# Altium schematic sheet SdpSchemRev1.SchDoc
size A
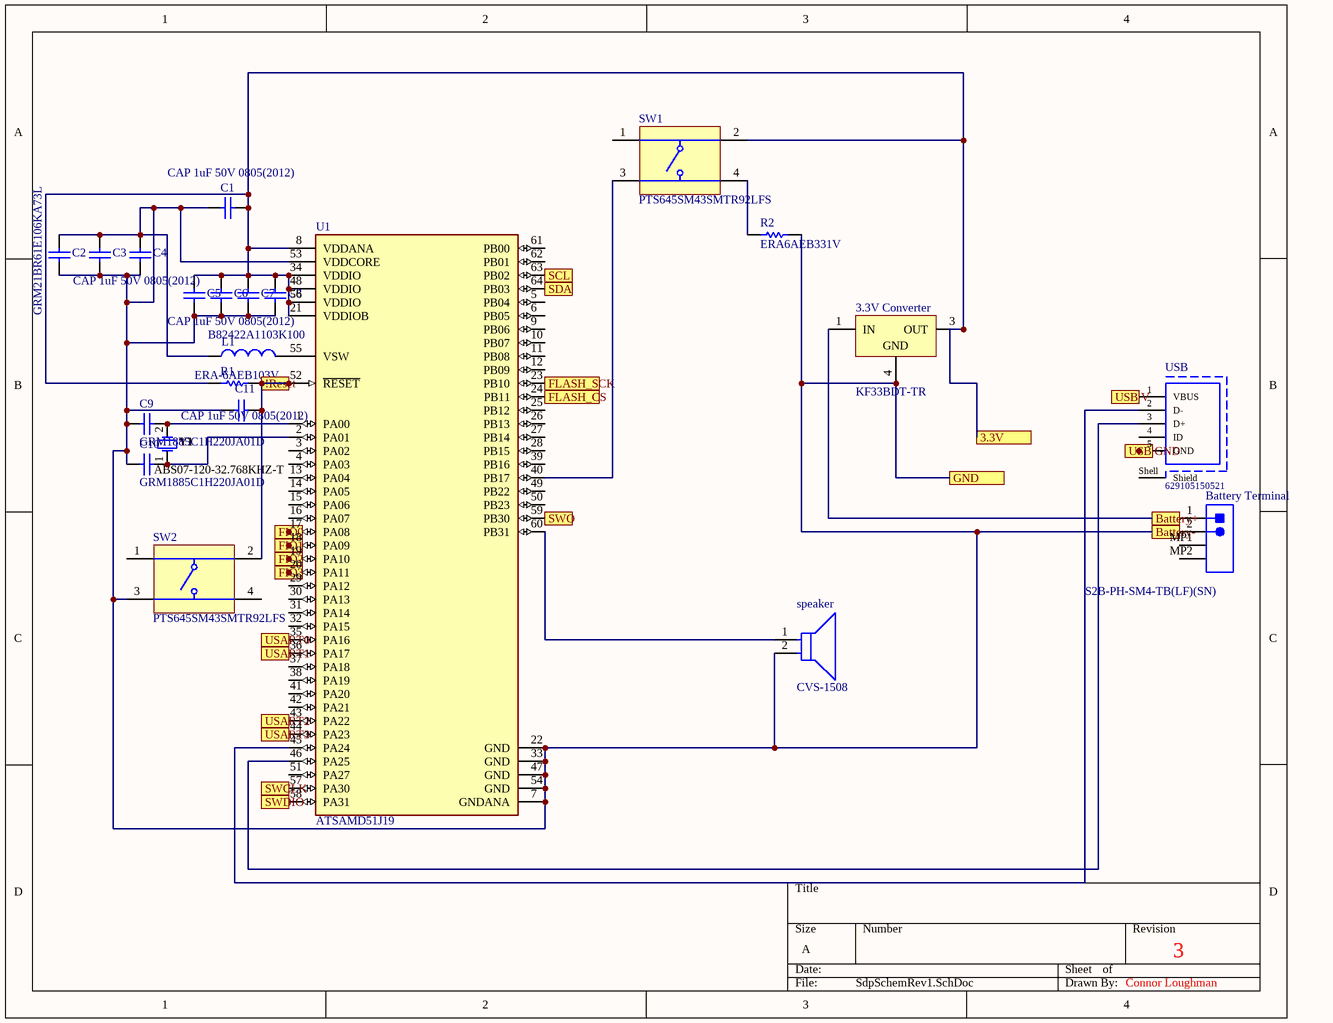
[diagram p0: SdpSchemRev1.SchDoc]

## Parts
3.3V_Converter  KF33BDT-TR  [TO-252_L]
Battery_Terminal  S2B-PH-SM4-TB(LF)(SN)  [JST- S2B-PH-SM4-TB(LF)(SN)-2_V]
C1  CAP 1uF 50V 0805(2012)  [CAPC0805(2012)145_L]
C2  GRM21BR61E106KA73L  [CAPC2013X135X45ML10T25]
C3  (no value)  [CAPC0805(2012)145_L]
C4  CAP 1uF 50V 0805(2012)  [CAPC0805(2012)145_L]
C5  (no value)  [CAPC0805(2012)145_L]
C6  (no value)  [CAPC0805(2012)145_L]
C7  (no value)  [CAPC0805(2012)145_L]
C8  CAP 1uF 50V 0805(2012)  [CAPC0805(2012)145_L]
C9  GRM1885C1H220JA01D  [CAPC1608X90X35ML10T15]
C10  GRM1885C1H220JA01D  [CAPC1608X90X35ML10T15]
C11  CAP 1uF 50V 0805(2012)  [CAPC0805(2012)145_L]
L1  B82422A1103K100  [TDK-B82422A1103K100_V]
R1  ERA-6AEB103V  [RESC2013X60X40LL20T25_A]
R2  ERA6AEB331V  [RESC2013X60X40LL20T25]
speaker  CVS-1508  [FP-CVS-1508-MFG]
SW1  PTS645SM43SMTR92LFS  [ITT-PTS645S-4_V]
SW2  PTS645SM43SMTR92LFS  [ITT-PTS645S-4_V]
U1  ATSAMD51J19  [FP-C04-085-MFG]
USB  629105150521  [629105150521]
Y1  ABS07-120-32.768KHZ-T  [ABRA-ABS07_A_V]

## Ports
3.3V, !Reset, Battery+, Battery-, FIO0, FIO1, FIO2, FIO3, FLASH_CS, FLASH_SCK, GND, SCL, SDA, SWCLK, SWDIO, SWO, USART0, USART1, USART2, USART3, USB GND, USB V

## Nets
3.3V: 3.3V_Converter.3(OUT) C1.2 C5.2 C6.2 C7.2 C8.2 R1.1 SW1.2 U1.8(VDDANA) U1.21(VDDIOB) U1.34(VDDIO) U1.48(VDDIO) U1.56(VDDIO) ; port 3.3V
!Reset: C11.2 R1.2 SW2.2 U1.52(~{RESET}) ; port !Reset
Battery+: 3.3V_Converter.1(IN) Battery_Terminal.1 ; port Battery+
Battery-: 3.3V_Converter.4(GND) Battery_Terminal.2 C1.1 C2.1 C2.2 C3.1 C3.2 C4.1 C4.2 C5.1 C6.1 C7.1 C8.1 C9.1 C10.1 C11.1 L1.1 R2.2 speaker.2(A) SW2.3 U1.7(GNDANA) U1.22(GND) U1.33(GND) U1.47(GND) U1.53(VDDCORE) U1.54(GND) ; port GND, port Battery-
FLASH_CS: U1.24(PB11) ; port FLASH_CS
FLASH_SCK: U1.23(PB10) ; port FLASH_SCK
SCL: U1.63(PB02) ; port SCL
SDA: U1.64(PB03) ; port SDA
SWCLK: U1.57(PA30) ; port SWCLK
SWDIO: U1.58(PA31) ; port SWDIO
SWO: U1.59(PB30) ; port SWO
USART0: U1.35(PA16) ; port USART0
USART1: U1.36(PA17) ; port USART1
USART2: U1.43(PA22) ; port USART2
USART3: U1.44(PA23) ; port USART3
USB V: USB.1(VBUS) ; port USB V
NetC9_2: C9.2 U1.1(PA00) Y1.2
NetC10_2: C10.2 U1.2(PA01) Y1.1
NetL1_2: L1.2 U1.55(VSW)
NetR2_1: R2.1 SW1.4
Netspeaker_1: speaker.1(C) U1.60(PB31)
NetSW1_3: SW1.3 U1.40(PB17)
NetU1_45: U1.45(PA24) USB.2(D-)
NetU1_46: U1.46(PA25) USB.3(D+)

Not connected (* = marked no-connect by the designer): Battery_Terminal MP1 MP2; SW1 1; SW2 1 4; U1 3(PA02) 4(PA03) 5(PB04) 6(PB05) 9(PB06) 10(PB07) 11(PB08) 12(PB09) 13(PA04) 14(PA05) 15(PA06) 16(PA07) 17(PA08) 18(PA09) 19(PA10) 20(PA11) 25(PB12) 26(PB13) 27(PB14) 28(PB15) 29(PA12) 30(PA13) 31(PA14) 32(PA15) 37(PA18) 38(PA19) 39(PB16) 41(PA20) 42(PA21) 49(PB22) 50(PB23) 51(PA27) 61(PB00) 62(PB01); USB 4(ID) 5(GND) Shell(Shield)

## Notes on the sheet
- 3
- Connor Loughman

## Library data of the parts
3.3V_Converter = CMP-0244-00072-1: Very Low Drop Voltage Regulators with Inhibit, 3.3V, 3-Pin DPAK, Tape and Reel; DatasheetVersion: 21/02/2008; ComponentLink2Description: Datasheet; ComponentLink1URL: http://www.st.com; PackageVersion: 2011; ComponentLink1Description: Manufacturer URL; PackageDescription: 3-Pin Transistor Outline Package 2.28 mm Pitch, 9.7 mm Lead Span (DPAK); ComponentLink2URL: http://www.st.com/internet/com/TECHNICAL_RESOURCES/TECHNICAL_LITERATURE/DATASHEET/CD00000970.pdf; PackageReference: TO-252
Battery_Terminal = CMP-1755-00001-1: Male Header, Pitch 2 mm, 1 x 2 Position, Height 5.5 mm, -25 to 85 degC, RoHS, Tape and Reel; Current Rating: 3 A; ComponentLink1URL: http://www.jst.com/home2.html; Radiation Hardening: No; RoHSCompliant: True; Mount: Through Hole; Contact Material: Bronze; Package Quantity: 100; Width: 2.34 mm; DatasheetVersion: Dec-12; Height: 8.13 mm; Max Operating Temperature: 105degC; ComponentLink2Description: Datasheet; Lead Pitch: 0.1 inch; Contact Finish: Lead; Packaging: Bulk; Colour: Black; Contact Plating: Tin; Min Operating Temperature: -65degC; ComponentLink1Description: Manufacturer URL; PackageReference: S2B-PH-SM4-TB(LF)(SN)-2; PackageDescription: Male Header, Pitch 2 mm, 1 x 2 Position, Height 5.5 mm; ComponentLink2URL: http://www.jst-mfg.com/product/pdf/eng/ePH.pdf; Pins: 40; Length: 101.19 mm
C1 C3-C8 C11 = CMP-1036-04761-1: CAP 1uF 50V ±10% 0805 (2012 Metric) Thickness 1.45mm SMD; Tolerance: Â±10%; Case-EIA: 0805; Case-Metric: 2012; Technology: SMT; Value: 1uF; Max Thickness: 1.45 mm; Rated Voltage: 50 V
C2 = CMP-2007-03541-1: Manufacturer: Murata; Part Number: GRM21BR61E106KA73L
C9 C10 = CMP-2000-04945-1: Chip Capacitor, 22 pF, +/- 5%, 50 V, -55 to 125 degC, 0603 (1608 Metric), RoHS, Tape and Reel; Manufacturer: Murata; Capacitance: 22pF; Rated Voltage: 50V; Dielectric: C0G; Manufacturer URL: http://www.murata.com/; Datasheet Version: Jul-06; Package Reference: 603; Tolerance (%): ±5%; Case Size/Dimension: 0603; Package Description: 2-Pin Surface Mount Device, Body 1.6 x 0.8 mm; Datasheet URL: https://datasheet.ciiva.com/11786/0900766b807a1cab-11786398.pdf
L1 = CMP-2000-05912-1: Wirewound Inductor, 10 uF, +/- 10%, 180 mA, -55 to 125 degC, 2-Pin SMD, RoHS, Tape and Reel; Manufacturer: EPCOS-(TDK); Frequency - Test: 1MHz; Current Rating: 180mA; Material - Core: Ferrite; Inductance: 10µH; DC Resistance (DCR): 1.6OhmMax; Q @ Freq: 27@2.52MHz; Frequency - Self Resonant: 25MHz; Shielding: Unshielded; Series: SIMID; Size / Dimension: 0.126"Lx0.098"W(3.20mmx2.50mm); Mounting Type: SurfaceMount; Current - Saturation: -; Operating Temperature: -; Datasheet URL: https://en.tdk.eu/inf/30/db/ind_2008/b82422a_100.pdf; Ratings: AEC-Q200; Category: Inductors,Coils,Chokes; Mounting Technology: SurfaceMount; Height - Seated (Max): 0.083"(2.10mm); Family: FixedInductors; Package / Case: 1210(3225Metric); Tolerance: ±10%; Manufacturer URL: http://www.tdk.com/; Datasheet Version: 10/2012; Type: Wirewound; Packaging: CutTape(CT); Package Description: 2-Pin Surface Mount Device, Body 3.2 x 2.5 mm; Package Reference: B82422A1103K100
R1 = CMP-2000-06228-1: Metal Film Chip Resistor, High Reliability Type, 0.125 W, +/- 0.1%, -55 to 155 degC, 0805 (2012 Metric), RoHS, Tape and Reel; Voltage Rating: 100V; Power Rating: 125mW(1/8W); Brand: Panasonic; Temperature Coefficient: 25PPM/C; Resistance: 10kOhms; Product Category: ThinFilmResistors-SMD; Datasheet Version: 02/2016; Operating Temperature Range: -55Cto+155C; Length: 2mm; Mounting Technology: SurfaceMount; Manufacturer URL: http://www.panasonic.com/; Width: 1.25mm; Packaging: Reel; Product: ThinFilmResistorsSMD; Package / Case: 0805(2012metric); Termination Style: SMD/SMT; Tolerance: 0.1%; Datasheet URL: https://industrial.panasonic.com/cdbs/www-data/pdf/RDM0000/AOA0000C307.pdf; Package Description: 2-Pin Surface Mount Device, Body 2 x 1.25 mm; Factory Pack Quantity: 5000; Series: ERA-6A; Case Code - mm: 2012; RoHS: Details; Package Reference: 0805; Height: 0.5mm; Manufacturer: Panasonic; Case Code - in: 0805; Type: MetalFilmChipResistors
R2 = CMP-2001-00628-1: Manufacturer: Panasonic; Part Number: ERA6AEB331V
speaker = CMP-14846-000001-1: SPEAKER 8OHM 300MW TOP PORT 87DB; Manufacturer: CUI Inc; Resistance: 8Ω; Value: 8Ω; Frequency: 1700Hz; Package: CVS-1508; Device Class L1: Electromechanical; Manufacturer Part Number: CVS-1508; Mouser Description: Speakers & Transducers Speakers; Temperature Range High: +55°C; Octopart: https://octopart.com/cvs-1508-cui-21325683; Device Class L2: Audio Products; Temperature Range Low: -20°C; Category: Speak; Digikey Description: SPEAKER 8OHM 300MW TOP PORT 87DB; Temperature: -20°C to +55°C; Height: 8mm; ComponentLink2Description: Datasheet; ComponentLink2URL: https://www.cui.com/product/resource/cvs-1508.pdf; Device Class L3: Speakers; Lead Free: Yes; RoHS: TRUE; Automotive: No
SW1 SW2 = CMP-2000-05160-1: 6 mm Tact Switche, SPST, NO, -20 to 60 degC, 4-Pin SMT, RoHS, Tape and Reel; Manufacturer: ITT Cannon; Manufacturer URL: http://www.ittcannon.com/; Datasheet Version: Feb-14; Datasheet URL: https://datasheet.ciiva.com/29903/getdatasheetpartid-786341-29903846.pdf
U1 = CMP-06276-000034-1: IC MCU 32BIT 1MB FLASH 64TQFP; Manufacturer Part Number: ATSAMD51J20A-AU; Manufacturer: Microchip; Data Bus Width: 32bits; Number Of Adc Channels: 24; Nominal Supply Current: 7mA; Number Of I2C Channels: 6; Interface: I2C,SPI,USART,USB,LIN,Ethernet,I2S,RS-485,Other; Max Supply Voltage: 3.63V; Number Of I/Os: 51; Ram Size: 256KBytes; Memory Size: 1MBytes; Number Of Cores: 1; Max Junction Temp: +105°C; Standoff Height: 0.05mm; Automotive Grade: Grade 1; Frequency: 120MHz; Number Of Pwm Channels: 2; Core Architecture: ARM Cortex-M4F; Min Supply Voltage: 1.71V; Number Of Timers/Counters: 8; Device Class L1: Integrated Circuits (ICs); Device Class L2: Embedded Processors and Controllers; Mouser Description: MCU 32-bit ARM Cortex M4F RISC 1MB Flash 3.3V 64-Pin TQFP Tray; Height: 1.2mm; Package: C04-085; RoHS: TRUE; Automotive: Yes; Device Class L3: Microcontrollers; ComponentLink2URL: http://ww1.microchip.com/downloads/en/DeviceDoc/60001507E.pdf; Temperature: -40°C to +85°C; Ambient Temperature Range Low: -40°C; Temperature Range High: +85°C; Category: IC; Temperature Range Low: -40°C; Number Of Ethernet Channels: 1; Ambient Temperature Range High: +85°C; Octopart: https://octopart.com/atsamd51j20a-au-microchip-83497274; Digikey Description: IC MCU 32BIT 1MB FLASH 64TQFP; Number Of Usb Channels: 1; Number Of Spi Channels: 6; Memory Type: FLASH; ComponentLink2Description: Datasheet; Number Of A/D Converters: 2; Lead Free: Yes
USB = CMP-1502-03252-1: Micro USB 2.0 Type B Receptacle WR-COM, Horizontal, SMT, with Pegs, High Current at Pin 1 & Pin 5; Manufacturer: Wurth Elektronik; Contact Resistance: 30mOhm; Rated Current: 3A; Working Voltage: 30VAC; Package Reference: 629105150521; Mounting Technology: SMT; Connector Type: MicroUSB2.0TypeB; Operating Temperature: -40to85degC; Orientation: Horizontal; Manufacturer URL: http://www.we-online.de; Datasheet URL: https://katalog.we-online.de/em/datasheet/629105150521.pdf; Part Number: 629105150521; Packaging: TapeandReel; Gender: Receptacle; Publisher: WurthElektronik
Y1 = CMP-2000-07587-1: Tuning Fork Crystal, 32.768 KHz, +/- 20 ppm, -40 to 85 degC, 2-Pin SMD, RoHS, Tape and Reel; Manufacturer: Abracon; Case\/Package: SMD/SMT; Series Resistance: 60KOhm; Frequency Tolerance: 20ppm; Load Capacitance: 6pF; ESR (Equivalent Series Resistance): 55KOhm; Max Operating Temperature: 85degC; Width: 0.061inch; Radiation Hardening: No; Lead Free: LeadFree; RoHSCompliant: True; Depth: 1.5mm; Datasheet URL: http://www.abracon.com/Resonators/ABS07-120-32.768kHz-T.pdf; Frequency: 32.768KHz; Termination: SMD/SMT; Manufacturer URL: http://www.abracon.com/; Package Quantity: 3000; Packaging: TapeandReel; Number of Pins: 2; Height: 0.035inch; Package Description: 2-Pin Surface Mount Device, Body 3.2 x 1.5 mm; Package Reference: ABS07; Mount: SurfaceMount; Tolerance: 20ppm; Mounting Technology: SurfaceMount; REACH SVHC: NoSVHC; Datasheet Version: 11/2014; Length: 3.2mm; Min Operating Temperature: -40degC